# EAGLE design programmer 328 (EAGLE 9.6.1)
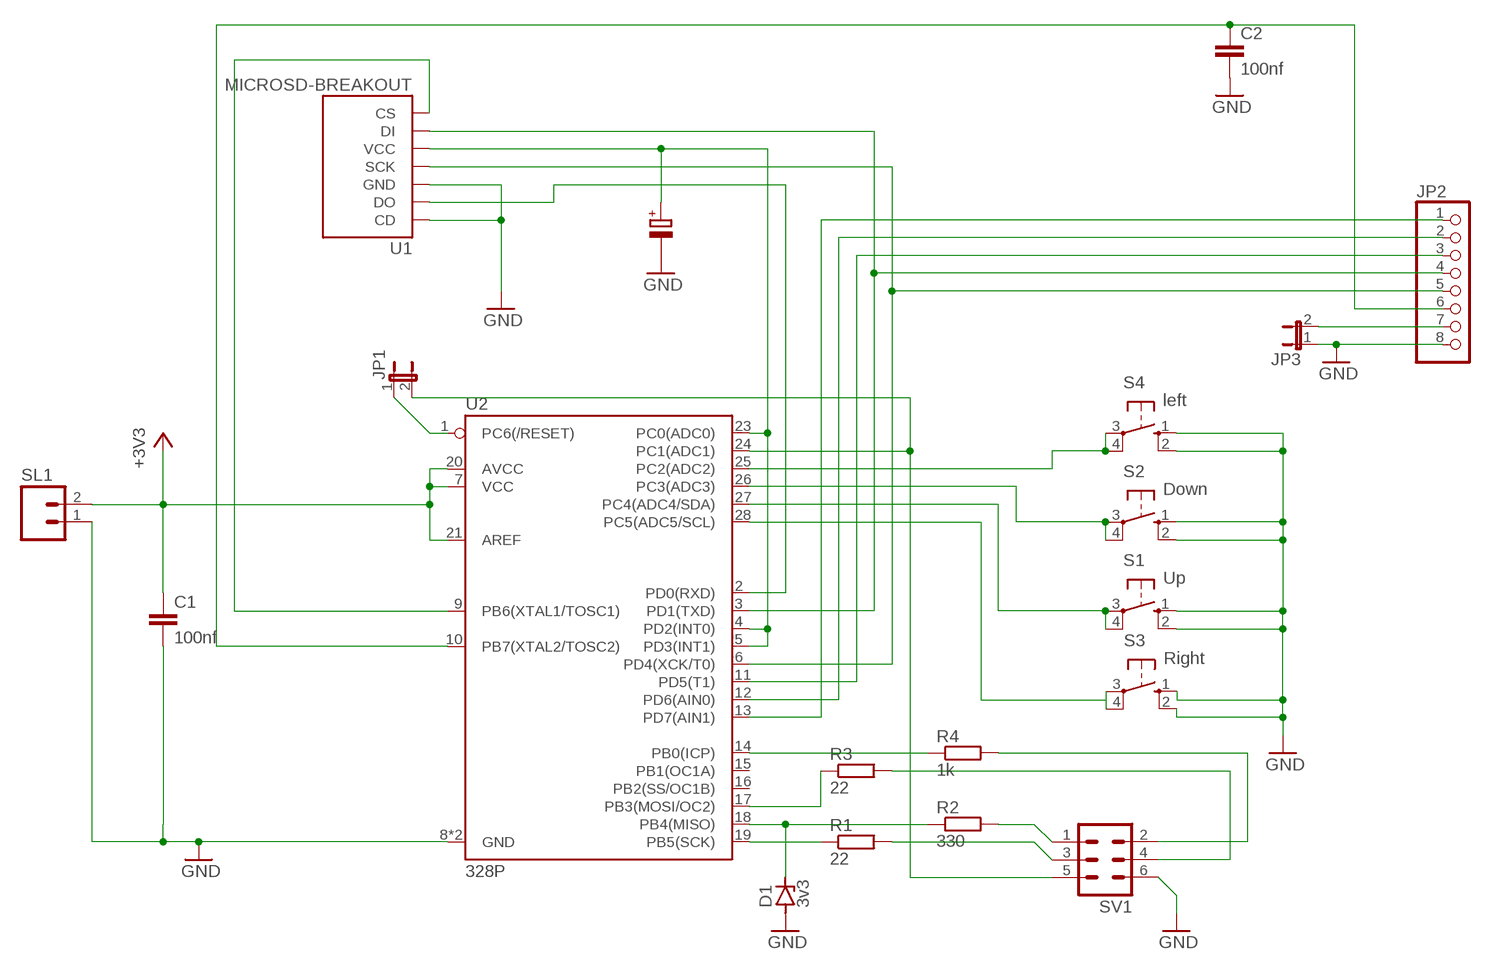
[diagram p0: schematic, sheet 1]

## Parts
C1  100nf  C2.5/2  [C2.5-2]
C2  100nf  C2.5/2  [C2.5-2]
D1  3v3  ZENER-DIODEDO41Z10  [DO41Z10]
JP1  JP1E  [JP1]
JP2  PINHD-1X8  [1X08]
JP3  JP1E  [JP1]
R1  22  R-EU_0207/12  [0207/12]
R2  330  R-EU_0207/12  [0207/12]
R3  22  R-EU_0207/12  [0207/12]
R4  1k  R-EU_0207/12  [0207/12]
S1  Up  10-XX  [B3F-10XX]
S2  Down  10-XX  [B3F-10XX]
S3  Right  10-XX  [B3F-10XX]
S4  left  10-XX  [B3F-10XX]
SL1  M02  [02P]
SV1  MA03-2  [MA03-2]
U1  MICROSD-BREAKOUT  [MICROSD-BREAKOUT]
U2  328P  ATMEGA328P_PDIP  [DIP28]

## Nets
+3V3: C1.1 SL1.2 U2.7(VCC) U2.20(AVCC) U2.21(AREF)
+5: R4.2 SV1.2
GND: C1.2 C2.2 D1.A JP2.8 JP3.1 S1.1(S) S1.2(S1) S2.1(S) S2.2(S1) S3.1(S) S3.2(S1) S4.1(S) S4.2(S1) SL1.1 SV1.6 U1.CD U1.GND U2.8(GND) U2.22(GND)
N$1: D1.C R2.1 U2.18(PB4(MISO))
N$2: R1.1 U2.19(PB5(SCK))
N$3: R1.2 SV1.3
N$4: R2.2 SV1.1
N$5: JP1.1 U2.1(PC6(/RESET))
N$6: JP1.2 SV1.5 U2.24(PC1(ADC1))
N$7: R3.1 U2.17(PB3(MOSI/OC2))
N$8: R4.1 U2.14(PB0(ICP))
N$9: R3.2 SV1.4
N$10: U1.VCC U2.4(PD2(INT0)) U2.5(PD3(INT1)) U2.23(PC0(ADC0))
N$11: S4.3(P) S4.4(P1) U2.25(PC2(ADC2))
N$12: S2.3(P) S2.4(P1) U2.26(PC3(ADC3))
N$13: S1.3(P) S1.4(P1) U2.27(PC4(ADC4/SDA))
N$14: S3.3(P) S3.4(P1)
N$15: U2.28(PC5(ADC5/SCL))
N$16: C2.1 JP2.6 U2.10(PB7(XTAL2/TOSC2))
N$17: JP2.7 JP3.2
N$18: U1.DO U2.2(PD0(RXD))
N$19: JP2.5 U1.SCK U2.6(PD4(XCK/T0))
N$20: JP2.4 U1.DI U2.3(PD1(TXD))
N$21: JP2.3 U2.11(PD5(T1))
N$22: JP2.2 U2.12(PD6(AIN0))
N$23: JP2.1 U2.13(PD7(AIN1))
N$24: U1.CS U2.9(PB6(XTAL1/TOSC1))
Unconnected: U2.15(PB1(OC1A)) U2.16(PB2(SS/OC1B))

## Library data of the parts
C1 C2 = capacitor-wima:C: CAPACITOR naming: grid - package width
D1 = diode:ZENER-DIODE: Z-Diode
JP1 JP3 = jumper:JP1E: JUMPER
JP2 = pinhead:PINHD-1X8: PIN HEADER
R1-R4 = rcl:R-EU_: RESISTOR, European symbol; SPICEPREFIX: R
S1-S4 = switch-omron:10-XX: OMRON SWITCH; MPN: B3F-1000; OC_FARNELL: 176432; OC_NEWARK: 36M3542
SL1 = con-amp-quick:M02: AMP QUICK CONNECTOR; OC_FARNELL: unknown; OC_NEWARK: unknown
SV1 = con-lstb:MA03-2: PIN HEADER; OC_FARNELL: unknown; OC_NEWARK: unknown
U1 = SparkFun-Boards:MICROSD-BREAKOUT
U2 = SparkFun-IC-Microcontroller:ATMEGA328P_PDIP: Atmel 328P Through hole ATMEGA328P uC used in the Arduino 32kb flash, 1k EEPROM, 2k SRAM Datasheet <http://www.sparkfun.com/datasheets/Components/SMD/ATMega328.pdf> SparkFun Products Storefront component: AVR 28 Pin 20MHz 32K 6A/D - ATMega328P <https://www.sparkfun.com/products/9061> (COM-09061) SparkFun Simon Says - Through-Hole Soldering Kit <https://www.sparkfun.com/products/10547> (KIT-10547) SparkFun Learn to Solder - Simon Says <https://www.sparkfun.com/products/13708> (KIT-13708) SparkFun BigTime Watch Kit <https://www.sparkfun.com/products/11734> (KIT-11734) SparkFun ClockIt <https://www.sparkfun.com/products/10930> (KIT-10930) SparkFun Serial Enabled LCD Kit <https://www.sparkfun.com/products/10097> (LCD-10097) SparkFun Simon Tilts - Through Hole Soldering Kit <https://www.sparkfun.com/products/12634> (KIT-12634) SparkFun Frequency Counter Kit <https://www.sparkfun.com/products/10140> (KIT-10140) FabFM Radio Kit <https://www.sparkfun.com/products/11043> (KIT-11043) SparkFun Binary Blaster Kit <https://www.sparkfun.com/products/12037> (KIT-12037) SparkFun Metro-Gnome <https://www.sparkfun.com/products/9236> (KIT-09236) ATmega328 with Arduino Optiboot (Uno) <https://www.sparkfun.com/products/10524> (DEV-10524); PROD_ID: IC-09136

## Board
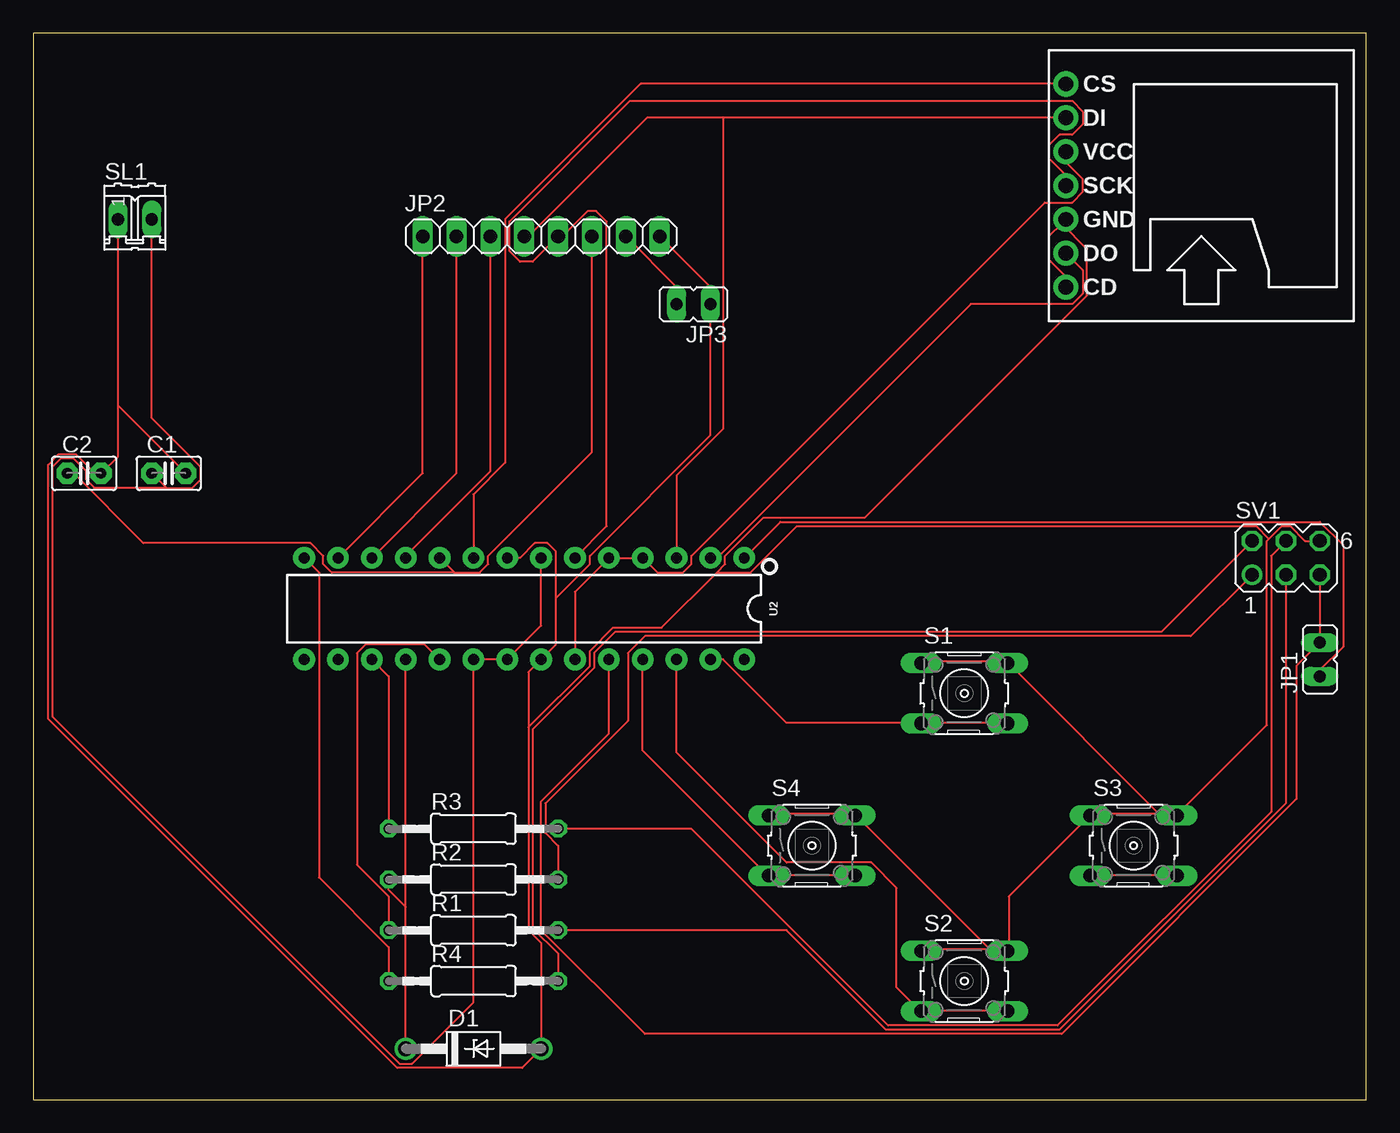
[diagram p1: board, top side]

Size 100 x 80 mm. Coordinates in mm from the lower left corner, seen from the top.
Outline: 0,0 100,0 100,80 0,80 0,0
Copper layers (1*16): Top 0.035mm / dielectric 1.5mm / Bottom 0.035mm
Design rules "default": minimum track width 6mil, minimum drill 0.35mm, track to track 6mil, track to pad 6mil, pad to pad 6mil, via to via 6mil, smd to smd 6mil, copper to edge 40mil, drill to drill 6mil, minimum pad ring 10mil, minimum via ring 8mil, stop-mask expansion 4mil, vias tented up to drill 0mil, thermal gap 10mil

### Footprints (pad centres in the part's own frame; a part is rotated, then mirrored left to right if it is on the bottom)
C2.5-2 = drill 0.813 pad 1.6 octagon: 1 -1.27,0; 2 1.27,0
DO41Z10 = drill 1.118: A 5.08,0; C -5.08,0
JP1 = drill 0.914 long: 1 0,-1.27; 2 0,1.27
1X08 = drill 1.016 long: 1 -8.89,0; 2 -6.35,0; 3 -3.81,0; 4 -1.27,0; 5 1.27,0; 6 3.81,0; 7 6.35,0; 8 8.89,0
0207/12 = drill 0.813 octagon: 1 -6.35,0; 2 6.35,0
B3F-10XX = drill 1.016 long: 1 -3.251,2.261; 2 3.251,2.261; 3 -3.251,-2.261; 4 3.251,-2.261
02P = drill 0.914 long: 1 -1.27,0; 2 1.27,0
MA03-2 = drill 1.016: 1 -2.54,-1.27 | drill 1.016 octagon: 2 -2.54,1.27; 3 0,-1.27; 4 0,1.27; 5 2.54,-1.27; 6 2.54,1.27
MICROSD-BREAKOUT = drill 1.118 pad 1.88: CD 12.7,8.89; CS 12.7,-6.35; DI 12.7,-3.81; DO 12.7,6.35; GND 12.7,3.81; SCK 12.7,1.27; VCC 12.7,-1.27
DIP28 = drill 0.813 pad 1.626: 1 -16.51,-3.81; 2 -13.97,-3.81; 3 -11.43,-3.81; 4 -8.89,-3.81; 5 -6.35,-3.81; 6 -3.81,-3.81; 7 -1.27,-3.81; 8 1.27,-3.81; 9 3.81,-3.81; 10 6.35,-3.81; 11 8.89,-3.81; 12 11.43,-3.81; 13 13.97,-3.81; 14 16.51,-3.81; 15 16.51,3.81; 16 13.97,3.81; 17 11.43,3.81; 18 8.89,3.81; 19 6.35,3.81; 20 3.81,3.81; 21 1.27,3.81; 22 -1.27,3.81; 23 -3.81,3.81; 24 -6.35,3.81; 25 -8.89,3.81; 26 -11.43,3.81; 27 -13.97,3.81; 28 -16.51,3.81

### Placement (x,y rotation side)
C1  10.16,46.99 0 top
C2  3.81,46.99 0 top
D1  33.02,3.81 0 top
JP1  96.52,33.02 0 top
JP2  38.1,64.77 0 top
JP3  49.53,59.69 90 top
R1  33.02,12.7 0 top
R2  33.02,16.51 0 top
R3  33.02,20.32 0 top
R4  33.02,8.89 0 top
S1  69.85,30.48 0 top
S2  69.85,8.89 0 top
S3  82.55,19.05 0 top
S4  58.42,19.05 0 top
SL1  7.62,66.04 0 top
SV1  93.98,40.64 0 top
U1  90.17,69.85 180 top
U2  36.83,36.83 180 top

### Tracks (layer width: path | path; a pad name or v marks a point on that pad's centre or on a via)
+3V3
  Top 0.152: U2.7 38.1,35.56 U2.21 U2.20 33.02,7.3 28.42,2.7 27.46,2.7 1.43,28.73 1.43,47.47 2.06,48.1 3.02,48.1 3.97,47.15 3.97,46.51 4.6,45.88 10,45.88 | SL1.2 8.89,51.12 12.54,47.47 12.54,46.51 11.91,45.88 10,45.88 | C1.1 10,45.88
+5
  Top 0.152: R4.2 39.37,10.95 37.47,12.86 37.47,27.78 42.07,32.38 42.07,33.5 43.66,35.08 84.61,35.08 SV1.2
GND
  Top 0.152: S4.1 55.24,21.43 61.59,21.43 S4.2 61.75,21.27 71.75,11.27 | 71.75,11.27 73.03,11.27 S2.2 | 71.75,11.27 66.67,11.27 S2.1 | 71.75,11.27 S2.2 | S1.1 66.67,32.86 73.03,32.86 S1.2 73.18,32.7 84.45,21.43 | 84.45,21.43 85.72,21.43 S3.2 | 84.45,21.43 79.38,21.43 S3.1 79.22,21.27 73.18,15.24 73.18,11.27 S2.2 | SV1.6 95.41,41.91 94.3,43.02 93.66,43.02 92.71,42.07 | 92.71,42.07 92.55,41.91 92.55,28.1 85.88,21.43 S3.2 | 84.45,21.43 S3.2 | 6.35,52.07 6.35,48.26 C2.2 4.6,46.99 3.17,48.42 1.91,48.42 1.11,47.62 1.11,28.57 27.3,2.38 36.67,2.38 D1.A 38.1,11.75 37.15,12.7 37.15,27.94 | 6.35,52.07 SL1.1 | 6.35,52.07 C1.2 | JP2.8 50.8,60.96 JP3.1 50.8,49.85 41.75,40.8 41.75,40.16 39.21,37.62 | U1.CD 77.47,61.75 76.2,63.02 76.2,64.77 77.15,65.72 | U2.8 36.51,40.64 37.62,41.75 38.58,41.75 39.21,41.12 39.21,37.62 | 39.21,37.62 39.21,34.13 U2.22 37.15,32.07 37.15,27.94 | 77.15,65.72 79.06,63.82 79.06,60.33 62.39,43.66 54.77,43.66 51.91,40.8 51.91,40.16 51.28,39.53 | 51.28,39.53 47.15,35.4 43.5,35.4 41.75,33.66 41.75,32.54 37.15,27.94 | 77.15,65.72 U1.GND | 92.71,42.07 91.76,43.02 57.31,43.02 53.82,39.53 51.28,39.53
N$1
  Top 0.152: R2.1 26.67,15.72 27.94,14.45 | D1.C 27.94,14.45 | 27.94,14.45 U2.18
N$2
  Top 0.152: R1.1 26.67,15.24 24.29,17.62 24.29,33.5 24.92,34.13 29.37,34.13 U2.19
N$3
  Top 0.152: R1.2 56.52,12.7 63.98,5.24 76.99,5.24 93.98,22.23 SV1.3
N$4
  Top 0.152: R2.2 39.37,19.05 38.42,20 38.42,22.23 44.61,28.42 44.61,33.5 45.88,34.77 86.84,34.77 SV1.1
N$5
  Top 0.152: JP1.1 96.52,32.23 98.27,33.97 98.27,41.59 96.52,43.34 56.04,43.34 U2.1
N$6
  Top 0.152: SV1.5 JP1.2 94.77,32.54 94.77,22.54 77.15,4.92 45.88,4.92 38.1,12.7 38.1,22.38 43.18,27.46 U2.24
N$7
  Top 0.152: R3.1 26.67,31.75 U2.17
N$8
  Top 0.152: R4.1 26.67,11.43 21.43,16.67 21.43,39.53 U2.14
N$9
  Top 0.152: R3.2 49.37,20.32 64.14,5.56 76.83,5.56 92.87,21.59 92.87,40.8 SV1.4
N$10
  Top 0.152: U2.23 40.64,38.1 U2.5 U2.4 46.83,39.53 48.74,39.53 49.37,40.16 49.37,40.8 75.88,67.31 77.95,67.31 78.74,68.1 78.74,69.06 77.47,70.33 U1.VCC
N$11
  Top 0.152: S4.4 61.59,16.83 55.24,16.83 S4.3 55.09,16.83 45.72,26.19 U2.25
N$12
  Top 0.152: S2.4 73.03,6.67 66.67,6.67 S2.3 66.52,6.67 64.77,8.41 64.77,15.88 62.87,17.78 56.52,17.78 48.26,26.04 U2.26
N$13
  Top 0.152: S1.4 73.03,28.26 66.67,28.26 S1.3 66.52,28.26 56.52,28.26 51.75,33.02 U2.27
N$14
  Top 0.152: S3.3 79.38,16.83 85.72,16.83 S3.4
N$16
  Top 0.152: JP2.6 41.91,48.58 34.13,40.8 34.13,40.16 33.5,39.53 31.59,39.53 | U2.10 31.59,39.53 | C2.1 3.02,46.99 8.26,41.75 20.8,41.75 21.75,40.8 21.75,40.16 22.38,39.53 31.59,39.53
N$17
  Top 0.152: JP3.2 48.26,60.96 JP2.7
N$18
  Top 0.152: U2.2 51.28,40.64 70.33,59.69 77.95,59.69 78.74,60.48 78.74,62.23 U1.DO
N$19
  Top 0.152: U2.6 43.02,43.02 43.02,65.88 42.23,66.67 41.59,66.67 39.69,64.77 JP2.5 37.47,62.87 36.51,62.87 35.72,63.66 35.72,65.88 44.77,74.93 77.95,74.93 78.74,74.14 78.74,73.18 77.95,72.39 76.99,72.39 76.2,71.6 76.2,70.64 77.47,69.37 U1.SCK
N$20
  Top 0.152: JP2.4 37.15,64.77 46.04,73.66 51.75,73.66 | U1.DI 51.75,73.66 | U2.3 48.26,46.83 51.75,50.32 51.75,73.66
N$21
  Top 0.152: JP2.3 34.29,47.15 27.94,40.8 U2.11
N$22
  Top 0.152: JP2.2 31.75,46.99 U2.12
N$23
  Top 0.152: JP2.1 29.21,46.99 U2.13
N$24
  Top 0.152: U2.9 33.02,45.4 35.4,47.78 35.4,66.04 45.56,76.2 U1.CS